# EAGLE design Servo_CAN_Node_REV-A (EAGLE 7.2.0)
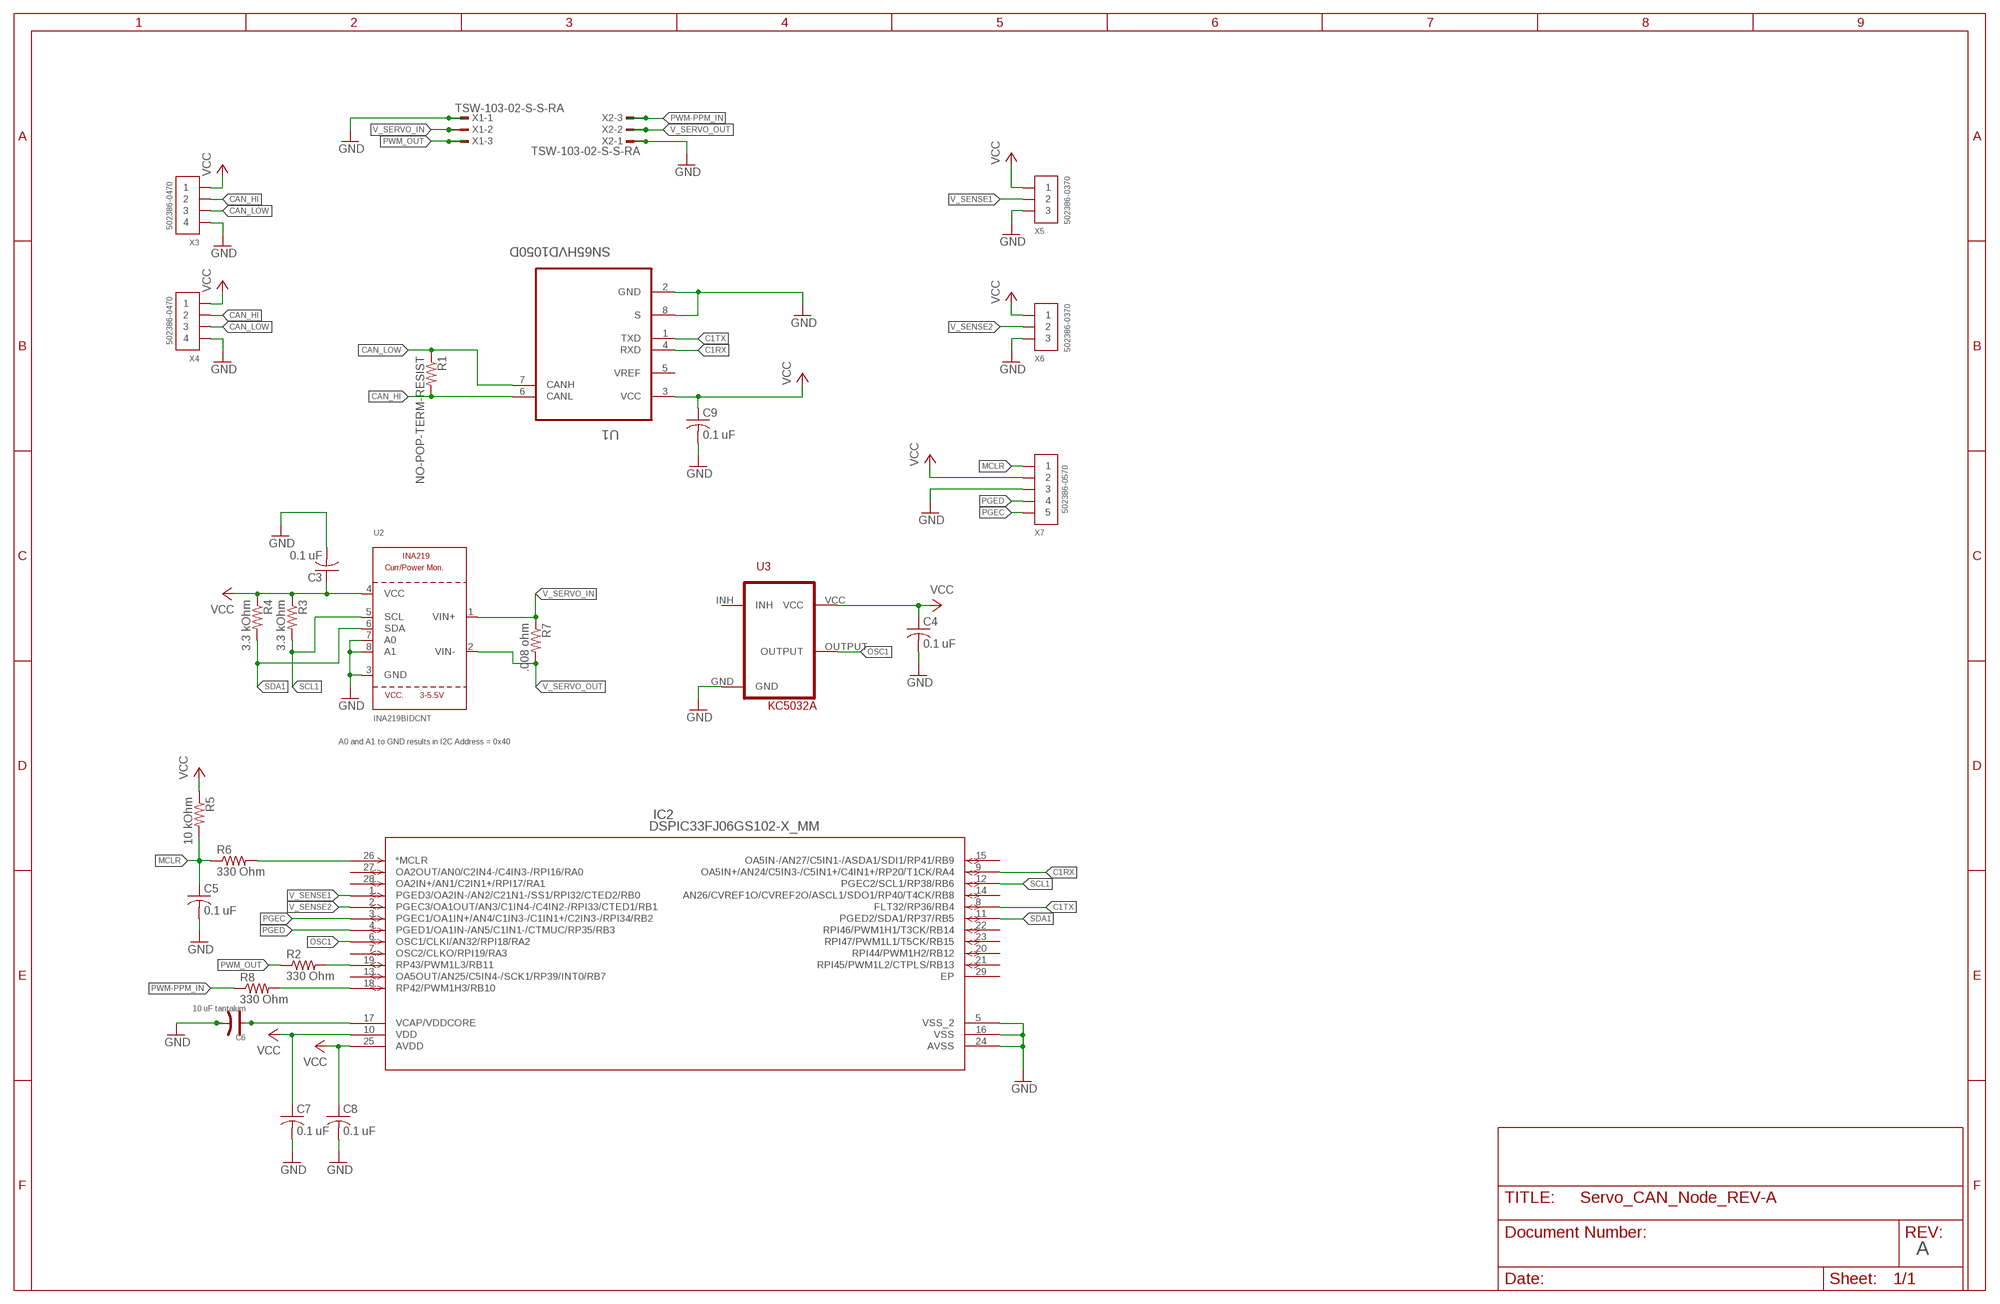
[diagram p0: schematic, sheet 1]

## Parts
C3  0.1 uF  C-USC0402  [C0402]
C4  0.1 uF  C-USC0402  [C0402]
C5  0.1 uF  C-USC0402  [C0402]
C6  10 uF tantalum  CAP-POLAR-AVX-A  [AVX-A]
C7  0.1 uF  C-USC0402  [C0402]
C8  0.1 uF  C-USC0402  [C0402]
C9  0.1 uF  C-USC0402  [C0402]
IC2  DSPIC33FJ06GS102-X_MM  [QFN-S28_6X6MC]
R1  NO-POP-TERM-RESIST  R-US_R0402  [R0402]
R2  330 Ohm  R-US_R0402  [R0402]
R3  3.3 kOhm  R-US_R0402  [R0402]
R4  3.3 kOhm  R-US_R0402  [R0402]
R5  10 kOhm  R-US_R0402  [R0402]
R6  330 Ohm  R-US_R0402  [R0402]
R7  .008 ohm  R-US_R0805  [R0805]
R8  330 Ohm  R-US_R0402  [R0402]
U1  SN65HVD1050D  [SOIC127P600X175-8N]
U2  INA219BIDCNT  INA219  [SOT23-8]
U3  KC5032A  [KC5032A]
X1  TSW-103-02-S-S-RA  [TSW-103-02-S-S-RA]
X2  TSW-103-02-S-S-RA  [TSW-103-02-S-S-RA]
X3  CONN_4-1-502386  [CM-502386-04]
X4  CONN_4-1-502386  [CM-502386-04]
X5  CONN_3-1-502386  [CM-502386-03]
X6  CONN_3-1-502386  [CM-502386-03]
X7  CONN_5-1-502386  [CM-502386-05]

## Nets
C1RX: IC2.9(OA5IN+/AN24/C5IN3-/C5IN1+/C4IN1+/RP20/T1CK/RA4) U1.4(RXD)
C1TX: IC2.8(FLT32/RP36/RB4) U1.1(TXD)
CAN_HI: R1.2 U1.6(CANL) X3.2 X4.2
CAN_LOW: R1.1 U1.7(CANH) X3.3 X4.3
GND: C3.2 C4.2 C5.2 C6.- C7.2 C8.2 C9.2 IC2.5(VSS_2) IC2.16(VSS) IC2.24(AVSS) U1.2(GND) U1.8(S) U2.3(GND) U2.7(A0) U2.8(A1) U3.GND X1.1 X2.1 X3.4 X4.4 X5.3 X6.3 X7.3
MCLR: C5.1 R5.2 R6.1 X7.1
MCLR_IC-SIDE: IC2.26(*MCLR) R6.2
N$2: C6.+ IC2.17(VCAP/VDDCORE)
OSC1: IC2.6(OSC1/CLKI/AN32/RPI18/RA2) U3.OUTPUT
PGEC: IC2.3(PGEC1/OA1IN+/AN4/C1IN3-/C1IN1+/C2IN3-/RPI34/RB2) X7.5
PGED: IC2.4(PGED1/OA1IN-/AN5/C1IN1-/CTMUC/RP35/RB3) X7.4
PWM-PPM_IN: R8.1 X2.3
PWM-PPM_IN_IC-SIDE: IC2.18(RP42/PWM1H3/RB10) R8.2
PWM_OUT: R2.1 X1.3
PWM_OUT_IC-SIDE: IC2.19(RP43/PWM1L3/RB11) R2.2
SCL1: IC2.12(PGEC2/SCL1/RP38/RB6) R3.2 U2.5(SCL)
SDA1: IC2.11(PGED2/SDA1/RP37/RB5) R4.2 U2.6(SDA)
V_SENSE1: IC2.1(PGED3/OA2IN-/AN2/C21N1-/SS1/RPI32/CTED2/RB0) X5.2
V_SENSE2: IC2.2(PGEC3/OA1OUT/AN3/C1IN4-/C4IN2-/RPI33/CTED1/RB1) X6.2
V_SERVO_IN: R7.1 U2.1(VIN+) X1.2
V_SERVO_OUT: R7.2 U2.2(VIN-) X2.2
VCC: C3.1 C4.1 C7.1 C8.1 C9.1 IC2.10(VDD) IC2.25(AVDD) R3.1 R4.1 R5.1 U1.3(VCC) U2.4(VCC) U3.VCC X3.1 X4.1 X5.1 X6.1 X7.2
Unconnected: IC2.7(OSC2/CLKO/RPI19/RA3) IC2.13(OA5OUT/AN25/C5IN4-/SCK1/RP39/INT0/RB7) IC2.14(AN26/CVREF1O/CVREF2O/ASCL1/SDO1/RP40/T4CK/RB8) IC2.15(OA5IN-/AN27/C5IN1-/ASDA1/SDI1/RP41/RB9) IC2.20(RPI44/PWM1H2/RB12) IC2.21(RPI45/PWM1L2/CTPLS/RB13) IC2.22(RPI46/PWM1H1/T3CK/RB14) IC2.23(RPI47/PWM1L1/T5CK/RB15) IC2.27(OA2OUT/AN0/C2IN4-/C4IN3-/RPI16/RA0) IC2.28(OA2IN+/AN1/C2IN1+/RPI17/RA1) IC2.29(EP) U1.5(VREF) U3.INH

## Notes on the sheet
- 502386-0370
- 502386-0470
- 502386-0370
- 502386-0470
- 502386-0570
- A0 and A1 to GND results in I2C Address = 0x40
- A

## Library data of the parts
C3-C5 C7-C9 = resistor:C-US: CAPACITOR, American symbol
C6 = Discrete:CAP-POLAR: Electrolytic Capacitors,Tantalum Capacitors and Super Capacitors
IC2 = dsPIC33EVxxxGM002_102_MM:DSPIC33FJ06GS102-X_MM
R1-R8 = resistor:R-US_: RESISTOR, American symbol
U1 = Texas Instruments_By_element14_Batch_1:SN65HVD1050D: EMC OPTIMIZED CAN TRANSCEIVER; MPN: SN65HVD1050D; OC_FARNELL: 1220984; OC_NEWARK: 70K4439; PACKAGE: SOIC-8; SUPPLIER: Texas Instruments
U2 = microbuilder:INA219: INA219 - I2C Current/Power Monitor Voltage Range: 0-26V Accuracy: 0.5% Temperature: -40�C - 125�C
U3 = KC5032A:KC5032A
X1 X2 = con-samtec:TSW-103-02-S-S: THROUGH-HOLE .025" SQ POST HEADER Source: Samtec TSW.pdf; OC_FARNELL: unknown; OC_NEWARK: unknown
X3 X4 = pel_molex:CONN_4-1
X5 X6 = pel_molex:CONN_3-1
X7 = pel_molex:CONN_5-1

## Board
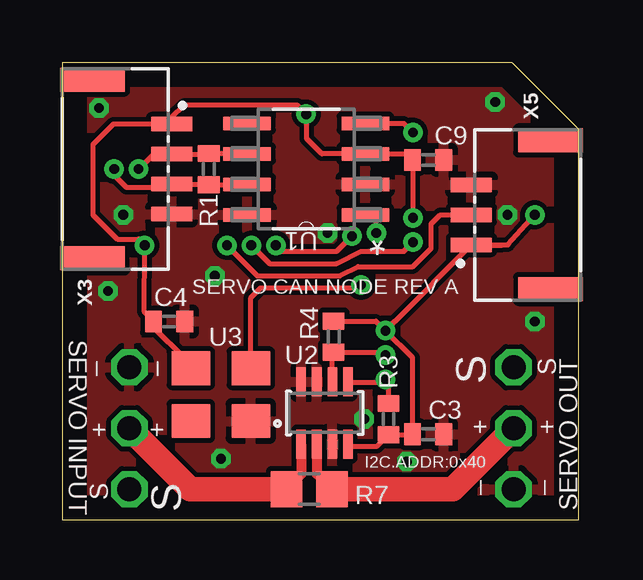
[diagram p1: board, top side]
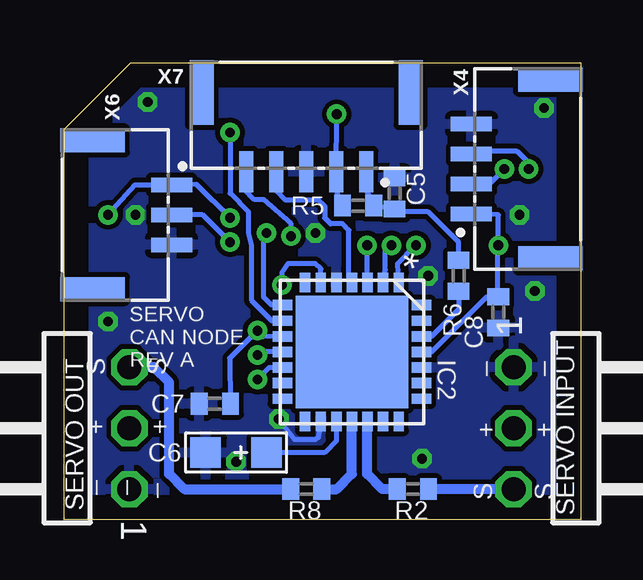
[diagram p2: board, bottom side, seen from below]

Size 21.51 x 19.04 mm. Coordinates in mm from the lower left corner, seen from the top.
Outline: 0,0 21.51,0 21.51,16.27 18.75,19.04 0,19.04 0,0
Copper layers (1*16): Top 0.035mm / dielectric 1.5mm / Bottom 0.035mm
Design rules "default *": minimum track width 8mil, minimum drill 15mil, track to track 8mil, track to pad 8mil, pad to pad 8mil, via to via 8mil, smd to smd 8mil, copper to edge 40mil, drill to drill 8mil, minimum pad ring 10mil, minimum via ring 8mil, stop-mask expansion 4mil, vias tented up to drill 17mil, thermal gap 10mil

### Footprints (pad centres in the part's own frame; a part is rotated, then mirrored left to right if it is on the bottom)
C0402 = smd 0.7 x 0.9: 1 -0.65,0; 2 0.65,0
AVX-A = smd 1.27 x 1.27: + -1.27,0; - 1.27,0
QFN-S28_6X6MC = smd 0.813 x 0.432: 1 -2.896,1.95; 2 -2.896,1.3; 3 -2.896,0.65; 4 -2.896,0; 5 -2.896,-0.65; 6 -2.896,-1.3; 7 -2.896,-1.95; 15 2.896,-1.95; 16 2.896,-1.3; 17 2.896,-0.65; 18 2.896,0; 19 2.896,0.65; 20 2.896,1.3; 21 2.896,1.95 | smd 0.432 x 0.813: 8 -1.95,-2.896; 9 -1.3,-2.896; 10 -0.65,-2.896; 11 0,-2.896; 12 0.65,-2.896; 13 1.3,-2.896; 14 1.95,-2.896; 22 1.95,2.896; 23 1.3,2.896; 24 0.65,2.896; 25 0,2.896; 26 -0.65,2.896; 27 -1.3,2.896; 28 -1.95,2.896 | smd 4.699 x 4.699: 29 0,0
R0402 = smd 0.7 x 0.9: 1 -0.65,0; 2 0.65,0
R0805 = smd 1.3 x 1.5: 1 -0.95,0; 2 0.95,0
SOIC127P600X175-8N = smd 1.981 x 0.559: 1 -2.464,1.905; 2 -2.464,0.635; 3 -2.464,-0.635; 4 -2.464,-1.905; 5 2.464,-1.905; 6 2.464,-0.635; 7 2.464,0.635; 8 2.464,1.905
SOT23-8 = smd 0.4 x 1.2: 1 -0.975,-1.3; 2 -0.325,-1.3; 3 0.325,-1.3; 4 0.975,-1.3; 5 0.975,1.3; 6 0.325,1.3; 7 -0.325,1.3; 8 -0.975,1.3
KC5032A = smd 1.6 x 1.4: GND 1.25,-1.1; INH -1.25,-1.1; OUTPUT 1.25,1.1; VCC -1.25,1.1
TSW-103-02-S-S-RA = drill 1 pad 1.5 octagon: 1 2.54,1.524; 2 0,1.524; 3 -2.54,1.524
CM-502386-04 = smd 0.6 x 1.7: 1 1.875,-4.55; 2 0.625,-4.55; 3 -0.625,-4.55; 4 -1.875,-4.55 | smd 1 x 2.7: P1 3.725,-1.25; P2 -3.725,-1.25
CM-502386-03 = smd 0.6 x 1.7: 1 1.25,-4.55; 2 0,-4.55; 3 -1.25,-4.55 | smd 1 x 2.7: P1 3.1,-1.25; P2 -3.1,-1.25
CM-502386-05 = smd 0.6 x 1.7: 1 2.5,-4.55; 2 1.25,-4.55; 3 0,-4.55; 4 -1.25,-4.55; 5 -2.5,-4.55 | smd 1 x 2.7: P1 4.35,-1.25; P2 -4.35,-1.25

### Placement (x,y rotation side)
C3  15.24,3.56 0 top
C4  4.45,8.26 0 top
C5  7.75,13.59 90 bottom
C6  14.35,2.79 180 bottom
C7  15.24,4.83 180 bottom
C8  3.43,8.64 270 bottom
C9  15.24,14.99 0 top
IC2  9.53,6.99 270 bottom
R1  6.1,14.61 90 top
R2  6.99,1.27 180 bottom
R3  13.59,4.19 90 top
R4  11.3,7.62 270 top
R5  9.27,13.08 0 bottom
R6  5.08,10.16 270 bottom
R7  10.29,1.27 0 top
R8  11.43,1.27 0 bottom
U1  10.16,14.61 180 top
U2  10.92,4.45 0 top
U3  6.6,5.21 0 top
X1  1.27,3.81 90 bottom
X2  20.32,3.81 270 bottom
X3  0,14.61 90 top
X4  0,14.61 270 bottom
X5  21.59,12.7 270 top
X6  21.59,12.7 90 bottom
X7  11.43,19.05 0 bottom

### Tracks (layer width: path | path; a pad name or v marks a point on that pad's centre or on a via)
C1RX  (via drill 0.41)
  Top 0.203: v14.61,16.13 14.22,16.51 U1.4
  Bottom 0.203: v14.61,16.13 14.61,13.59 13.84,12.83 13.84,11.94 13.72,11.43 13.72,9.14 12.86,8.29 IC2.9
C1TX  (via drill 0.41)
  Top 0.203: v13.08,11.94 13.08,12.45 U1.1
  Bottom 0.203: IC2.8 12.87,8.94 13.21,9.27 13.21,11.68 v13.08,11.94
CAN_HI  (via drill 0.41)
  Top 0.203: v3.17,14.61 3.8,15.23 X3.2 6.07,15.23 R1.2 7.68,15.26 U1.6 7.69,15.23
  Bottom 0.203: v3.17,14.61 3.8,13.98 X4.2
CAN_LOW  (via drill 0.41)
  Top 0.203: v2.16,14.61 2.16,14.35 2.67,13.84 4.41,13.84 X3.3 | X3.3 | 7.69,13.98 U1.7 7.68,13.96 R1.1 6.07,13.98 X3.3
  Bottom 0.203: X4.3 4.41,15.37 2.67,15.37 2.16,14.86 v2.16,14.61
GND  (via drill 0.41)
  Bottom 0.203: IC2.16 10.92,3.43 11.05,3.33 11.91,3.33 v12.57,4.19
  other vias: 18.03,17.4 2.54,12.7 1.52,17.14 18.54,12.7 6.6,2.54 11.05,11.94 6.35,10.16 1.91,9.53 19.68,8.26 14.35,2.41
  pour Top: -1.27,-1.27 24.13,-1.27 24.13,20.32 -1.27,20.32
  pour Bottom: -1.27,-1.27 24.13,-1.27 24.13,20.32 -1.27,20.32
MCLR
  Bottom 0.203: X7.1 8.93,13.77 R5.2 C5.1 7.63,12.83 6.35,12.83 5.08,11.56 R6.1
MCLR_IC-SIDE
  Bottom 0.203: R6.2 5.08,8.76 6.21,7.63 IC2.26
N$2
  Bottom 0.203: IC2.17 10.18,3.29 10.67,2.79 C6.+
OSC1  (via drill 0.41)
  Top 0.203: U3.OUTPUT 7.85,9.25 8.26,9.65 12.06,9.65 v12.45,9.78
  Bottom 0.203: IC2.6 10.82,10.44 11.05,10.67 12.19,10.67 12.45,10.29 v12.45,9.78
PGEC  (via drill 0.41)
  Top 0.203: v8.89,11.43 9.14,11.18 11.43,11.18 v12.06,11.81
  Bottom 0.203: IC2.3 8.89,10.28 v8.89,11.43 | 13.93,14.56 X7.5 13.93,14.01 13.97,13.72 13.59,13.34 13.21,13.34 12.06,12.32 v12.06,11.81
PGED
  Bottom 0.203: IC2.4 9.65,10.03 9.65,12.06 9.91,12.32 10.41,12.32 10.67,12.57 10.67,13.08 10.92,13.34 12.32,13.34 12.68,13.7 X7.4
PWM-PPM_IN
  Bottom 0.406: X2.3 17.78,6.35 17.14,5.71 17.14,1.91 16.51,1.27 R8.1
PWM-PPM_IN_IC-SIDE
  Bottom 0.406: R8.2 10.16,1.27 9.53,1.91 IC2.18
PWM_OUT
  Bottom 0.406: X1.3 R2.1
PWM_OUT_IC-SIDE
  Bottom 0.406: R2.2 8.26,1.27 8.89,1.91 8.89,3.44 IC2.19
SCL1  (via drill 0.41)
  Top 0.203: U2.5 12.02,5.71 13.34,5.71 v13.46,5.84 13.59,5.71 R3.2
  Bottom 0.203: v13.46,5.84 12.97,6.33 IC2.12
SDA1  (via drill 0.41)
  Top 0.203: U2.6 11.25,6.79 R4.2 13.22,6.97 v13.46,6.86
  Bottom 0.203: IC2.11 13.34,6.99 v13.46,6.86
V_SENSE1  (via drill 0.41)
  Top 0.203: X5.2 15.75,12.7 15.37,12.32 15.37,11.3 14.61,10.54 12.32,10.54 11.56,10.16 8.13,10.16 v6.86,11.43
  Bottom 0.203: IC2.1 7.62,10.67 v6.86,11.43
V_SENSE2  (via drill 0.41)
  Top 0.203: v7.87,11.43 8.64,10.67 11.43,10.67 12.45,11.18 14.22,11.18 v14.61,11.56
  Bottom 0.203: IC2.2 8.13,10.41 8.13,11.18 v7.87,11.43 | v14.61,11.56 15.75,12.7 X6.2
V_SERVO_IN
  Top 0.406: U2.1 9.95,1.88 R7.1
  Top 1.016: R7.1 5.33,1.27 X1.2
V_SERVO_OUT
  Top 0.406: U2.2 10.6,1.91 R7.2
  Top 1.016: R7.2 16.26,1.27 X2.2
VCC  (via drill 0.41)
  Top 0.203: U2.4 11.94,3.05 13.1,3.05 R3.1 14.57,3.54 C3.1 14.59,6.75 v13.46,7.87 | U3.VCC 5.35,6.7 5.12,6.7 3.81,8 C4.1 3.41,8.65 v3.43,11.43 3.17,11.68 2.29,11.68 1.27,12.7 1.27,15.62 2.13,16.48 X3.1 4.54,16.73 5.08,17.27 9.78,17.27 v10.16,16.89 10.17,16.88 10.17,15.88 10.81,15.24 U1.3 14.34,15.24 C9.1 14.59,12.59 v14.61,12.57 | X5.1 18.56,11.45 v19.68,12.7 | 17.78,11.43 18.29,11.43 X5.1 | R4.1 13.07,8.27 v13.46,7.87 | X5.1 13.86,8.27 v13.46,7.87
  Bottom 0.203: IC2.10 13.21,7.62 v13.46,7.87 14.62,6.73 C7.1 | IC2.25 6.21,6.99 3.92,9.27 3.44,9.27 | 3.44,9.27 C8.1 | 3.44,9.27 3.44,11.41 v3.43,11.43 3.43,12.7 X4.1 | R5.1 10.18,13.72 X7.2 | X7.2 10.17,15.14 | X7.2 v10.16,16.89 | v19.68,12.7 18.56,13.95 X6.1 16,13.97 v14.61,12.57

### Text on the board
tNames: SERVO CAN NODE REV A | SERVO INPUT | _ | _ | U3 | S | S | + | + | + | + | I2C.ADDR:0x40 | S | S | _ | _ | SERVO OUT
bNames: SERVO / CAN NODE / REV A | SERVO INPUT | _ | _ | S | S | + | + | + | + | S | S | _ | _ | _ | SERVO OUT